# EAGLE design Cap Touch Matrix FeatherWing (EAGLE 9.4.2)
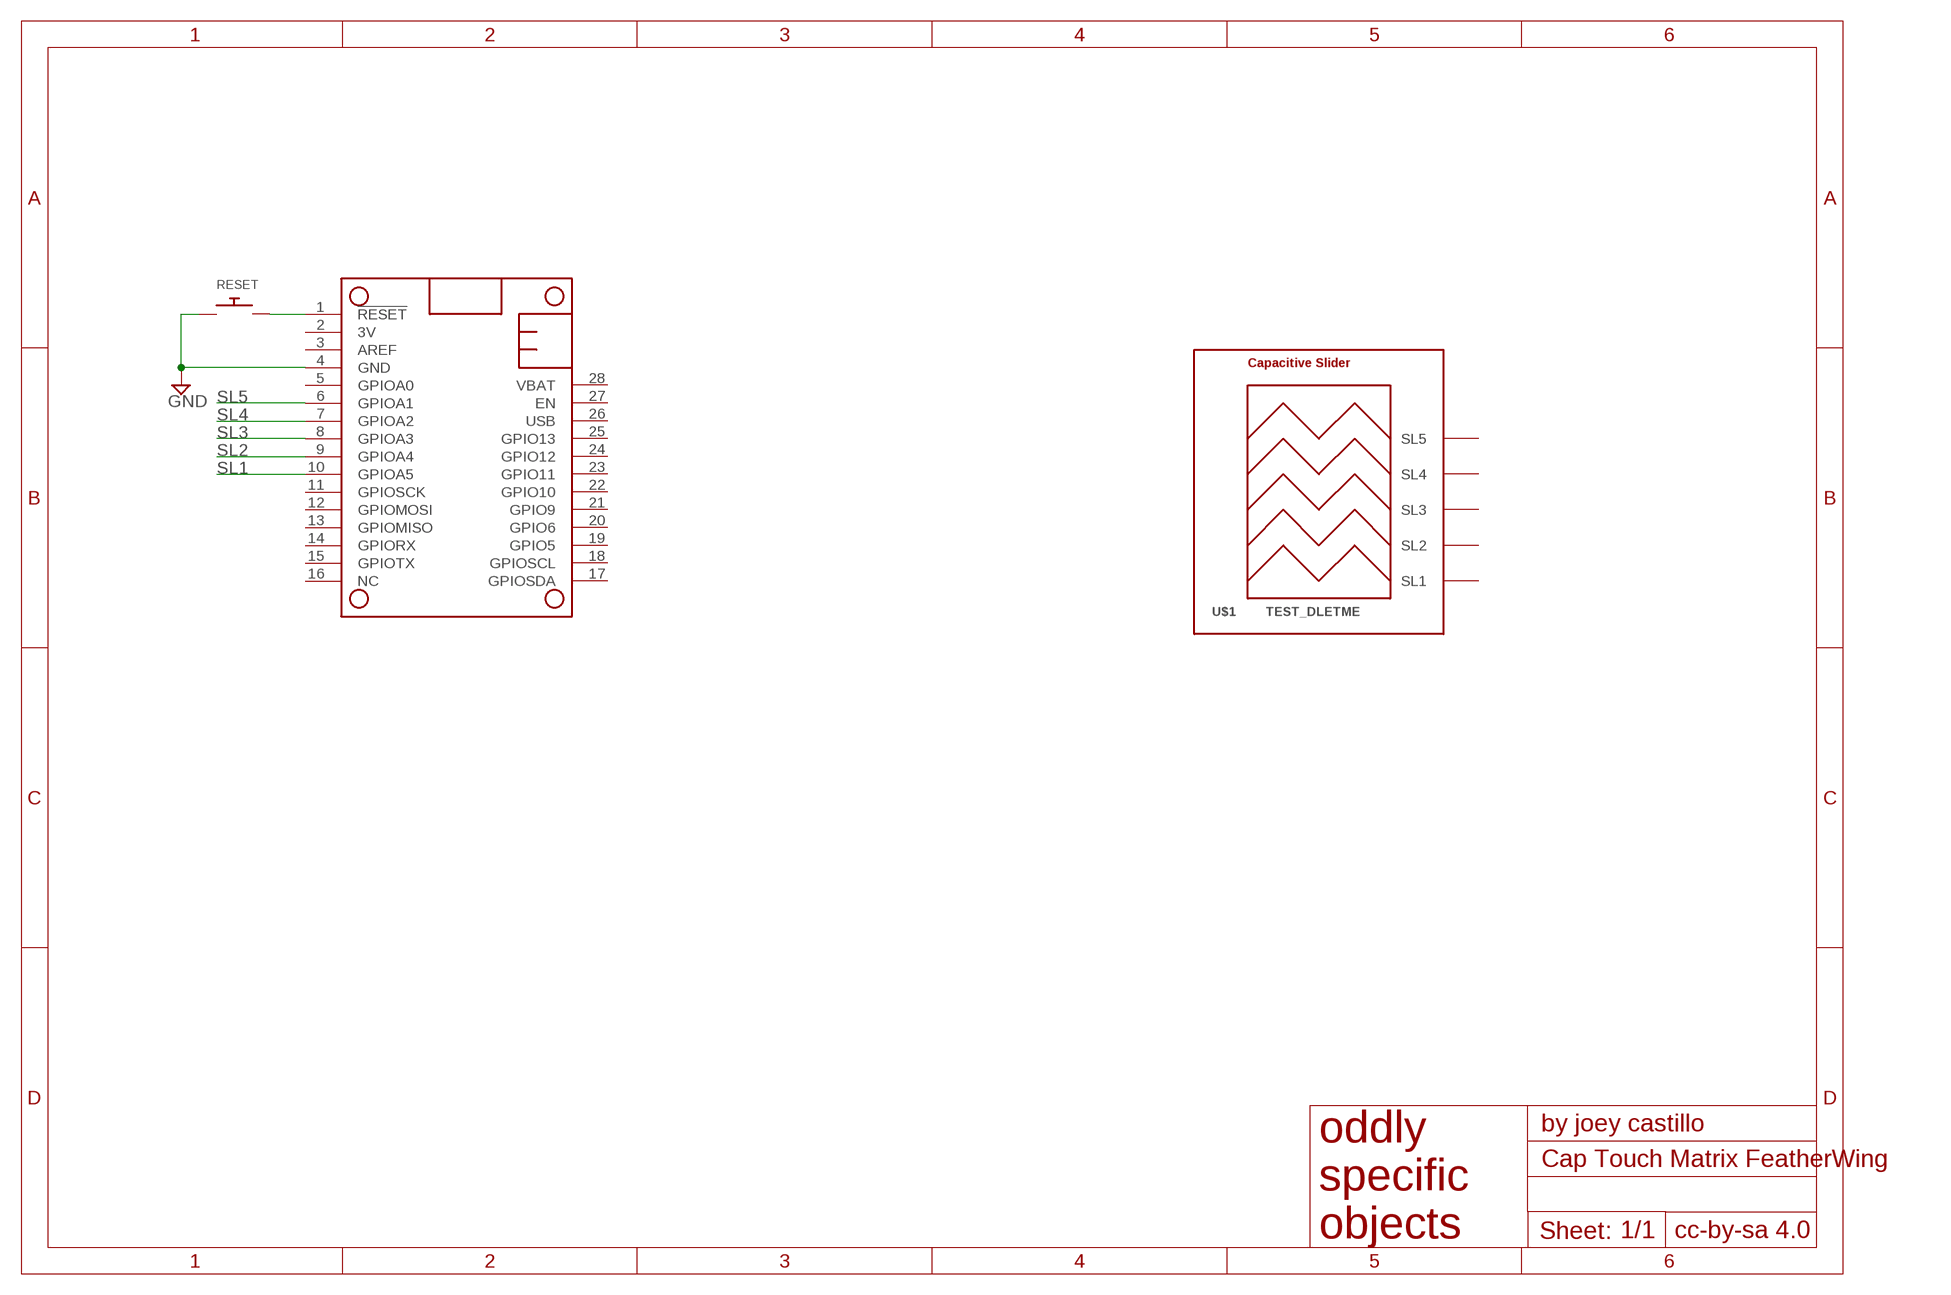
[diagram p0: schematic, sheet 1]

## Parts
MS1  FEATHERWING  [FEATHERWING]
RESET  SPST_TACTILE_SWITCHRA-THRU  [MJTP1117]
U$1  TEST_DLETME  [MATRIX_PASSIVE_5X7SEG_4MM]

## Nets
!RESET: MS1.1(!RESET) RESET.P$2
GND: MS1.4(GND) RESET.P$1
SL1: MS1.10(GPIOA5)
SL2: MS1.9(GPIOA4)
SL3: MS1.8(GPIOA3)
SL4: MS1.7(GPIOA2)
SL5: MS1.6(GPIOA1)
Unconnected: MS1.2(3V) MS1.3(AREF) MS1.5(GPIOA0) MS1.11(GPIOSCK) MS1.12(GPIOMOSI) MS1.13(GPIOMISO) MS1.14(GPIORX) MS1.15(GPIOTX) MS1.16(NC) MS1.17(GPIOSDA) MS1.18(GPIOSCL) MS1.19(GPIO5) MS1.20(GPIO6) MS1.21(GPIO9) MS1.22(GPIO10) MS1.23(GPIO11) MS1.24(GPIO12) MS1.25(GPIO13) MS1.26(USB) MS1.27(EN) MS1.28(VBAT) U$1.P1(SL1) U$1.P2(SL2) U$1.P3(SL3) U$1.P41(SL4) U$1.P42(SL5)

## Library data of the parts
MS1 = microbuilder:FEATHERWING
RESET = My Stuff:SPST_TACTILE_SWITCH
U$1 = PatternAgents-TouchWidgets:TEST_DLETME

## Board
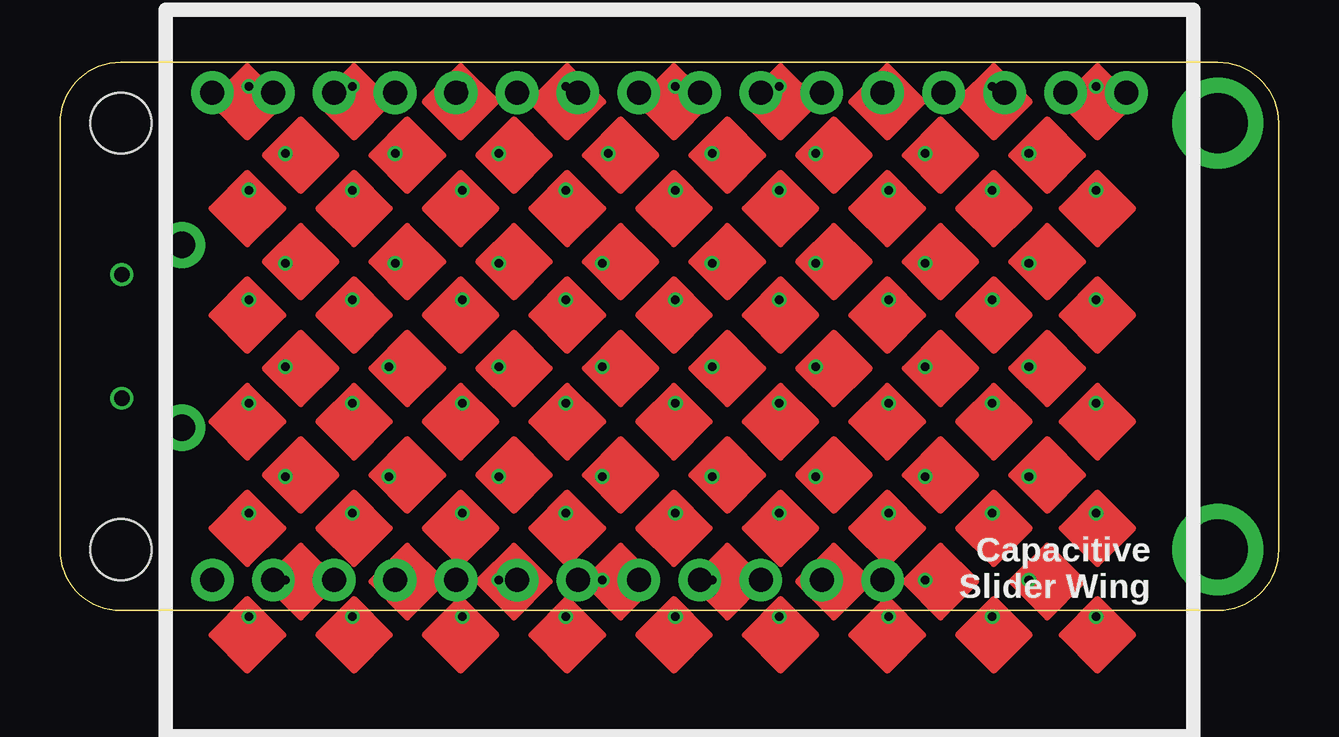
[diagram p1: board, top side]
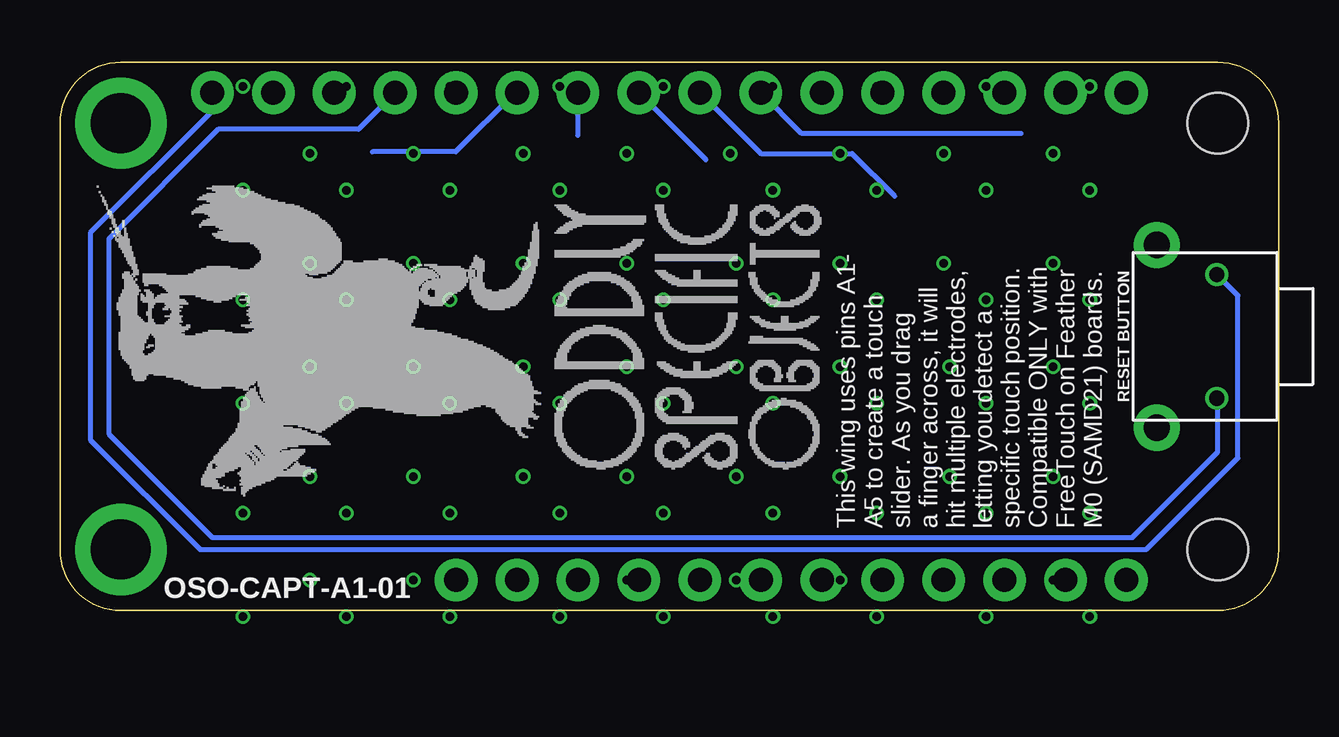
[diagram p2: board, bottom side, seen from below]

Size 50.8 x 22.86 mm. Coordinates in mm from the lower left corner, seen from the top.
Outline: 48.26,0 2.54,0 arc-90 0,2.54 0,20.32 arc-90 2.54,22.86 48.26,22.86 arc-90 50.8,20.32 50.8,2.54 arc-90 48.26,0
Copper layers (1*16): Top 0.035559375mm / dielectric 1.6mm / Bottom 0.035559375mm
Design rules "oshpark-2layer": minimum track width 6mil, minimum drill 10mil, track to track 6mil, track to pad 6mil, pad to pad 6mil, via to via 6mil, smd to smd 6mil, copper to edge 15mil, drill to drill 6mil, minimum pad ring 5mil, minimum via ring 5mil, stop-mask expansion 2.5mil, vias tented up to drill 0mil, thermal gap 10mil

### Footprints (pad centres in the part's own frame; a part is rotated, then mirrored left to right if it is on the bottom)
FEATHERWING = drill 1 pad 1.778: 1 6.35,1.27; 2 8.89,1.27; 3 11.43,1.27; 4 13.97,1.27; 5 16.51,1.27; 6 19.05,1.27; 7 21.59,1.27; 8 24.13,1.27; 9 26.67,1.27; 10 29.21,1.27; 11 31.75,1.27; 12 34.29,1.27; 13 36.83,1.27; 14 39.37,1.27; 15 41.91,1.27; 16 44.45,1.27; 17 44.45,21.59; 18 41.91,21.59; 19 39.37,21.59; 20 36.83,21.59; 21 34.29,21.59; 22 31.75,21.59; 23 29.21,21.59; 24 26.67,21.59; 25 24.13,21.59; 26 21.59,21.59; 27 19.05,21.59; 28 16.51,21.59 | drill 2.5 pad 3.81: P$1 2.54,20.32; P$2 2.54,2.54 | hole 2.54: 48.26,20.32; 48.26,2.54
MJTP1117 = drill 0.635: P$1 -2.58,0.04; P$2 2.58,0.04 | drill 1.1 pad 1.93: P$5 -3.81,2.54; P$6 3.81,2.54
MATRIX_PASSIVE_5X7SEG_4MM = drill 0.356: P1 19.812,0.762; P2 19.812,-3.81; P3 19.812,-8.128; P41 -15.494,-8.128; P42 -11.176,-8.128; P43 -6.604,-8.128; P44 -2.286,-8.128; P45 2.286,-8.128; P46 6.604,-8.128; P47 11.176,-8.128; P48 15.494,-8.128; P51 -13.97,-6.604; P52 -9.652,-6.604; P53 -5.08,-6.604; P54 -0.762,-6.604; P55 3.81,-6.604; P56 8.128,-6.604; P57 12.7,-6.604; P58 17.018,-6.604; P61 -15.494,-3.81; P62 -11.176,-3.81; P63 -6.604,-3.81; P64 -2.286,-3.81; P65 2.286,-3.81; P66 6.604,-3.81; P67 11.176,-3.81; P68 15.494,-3.81; P71 -13.97,-2.286; P72 -9.652,-2.286; P73 -5.08,-2.286; P74 -0.762,-2.286; P75 3.81,-2.286; P76 8.128,-2.286; P77 12.7,-2.286; P78 17.018,-2.286; P81 -15.494,0.762; P82 -11.176,0.762; P83 -6.604,0.762; P84 -2.286,0.762; P85 2.286,0.762; P86 6.604,0.762; P87 11.176,0.762; P88 15.494,0.762; P91 -13.97,2.286; P92 -9.652,2.286; P93 -5.08,2.286; P94 -0.762,2.286; P95 3.81,2.286; P96 8.128,2.286; P97 12.7,2.286; P98 17.018,2.286; PA1 -15.494,5.08; PA2 -11.176,5.08; PA3 -6.604,5.08; PA4 -2.286,5.08; PA5 2.286,5.08; PA6 6.604,5.08; PA7 11.176,5.08; PA8 15.494,5.08; PA9 19.812,5.08; PB1 -13.97,6.604; PB2 -9.398,6.604; PB3 -5.08,6.604; PB4 -0.762,6.604; PB5 3.81,6.604; PB6 8.128,6.604; PB7 12.7,6.604; PB8 17.018,6.604; PC1 -15.494,9.652; PC2 -11.176,9.652; PC3 -6.604,9.652; PC4 -2.286,9.652; PC5 2.286,9.652; PC6 6.604,9.652; PC7 11.176,9.652; PC8 15.494,9.652; PC9 19.812,9.652; PD1 -13.97,11.176; PD2 -9.398,11.176; PD3 -5.08,11.176; PD4 -0.508,11.176; PD5 3.81,11.176; PD6 8.128,11.176; PD7 12.7,11.176; PD8 17.018,11.176; PE1 -15.494,13.97; PE2 -11.176,13.97; PE3 -6.604,13.97; PE4 -2.286,13.97; PE5 2.286,13.97; PE6 6.604,13.97; PE7 11.176,13.97; PE8 15.494,13.97; PE9 19.812,13.97

### Placement (x,y rotation side)
MS1  50.8,22.86 180 top
RESET  2.54,11.43 90 bottom
U$1  23.37,7.87 0 top
U$45  OSO_BEAR  [OSO_BEAR_750MIL]  39.62,11.43 90 bottom
U$47  OSO_TEXT  [OSO_TEXT_435MIL]  24.21,11.43 90 bottom
U$48  OSO_TEXTOSO_TEXT_ONELINE_125MIL  [OSO_ONELINE_125MIL]  108.46,-23.52 90 top  (outside the outline)

### Tracks (layer width: path | path; a pad name or v marks a point on that pad's centre or on a via)
!RESET
  Bottom 0.203: MS1.1 44.45,20.83 49.53,15.75 49.53,7.11 44.96,2.54 5.52,2.54 1.7,6.36 1.7,13.13 RESET.P$2
GND
  Bottom 0.203: MS1.4 38.35,20.07 44.2,20.07 48.77,15.49 48.77,7.37 44.45,3.05 6.1,3.05 2.54,6.6 2.54,8.81 RESET.P$1
SL1
  Bottom 0.203: 10.74,19.89 19.89,19.89 MS1.10
SL2
  Bottom 0.203: MS1.9 21.59,19.05 17.78,19.05 16,17.27
SL3
  Bottom 0.203: MS1.8 23.88,18.8
SL4
  Bottom 0.203: 29.21,19.81 MS1.7
SL5
  Bottom 0.203: MS1.6 31.84,21.59 34.3,19.13 37.77,19.13

### Text on the board
tPlace: Capacitive / Slider Wing
bPlace: RESET BUTTON | This wing uses pins A1- / A5 to create a touch / slider. As you drag / a finger across, it will / hit multiple electrodes, / letting you detect a / specific touch position. / Compatible ONLY with / FreeTouch on Feather / M0 (SAMD21) boards. | OSO-CAPT-A1-01